# EAGLE schematic leddriver2X3 (EAGLE 9.4.2)
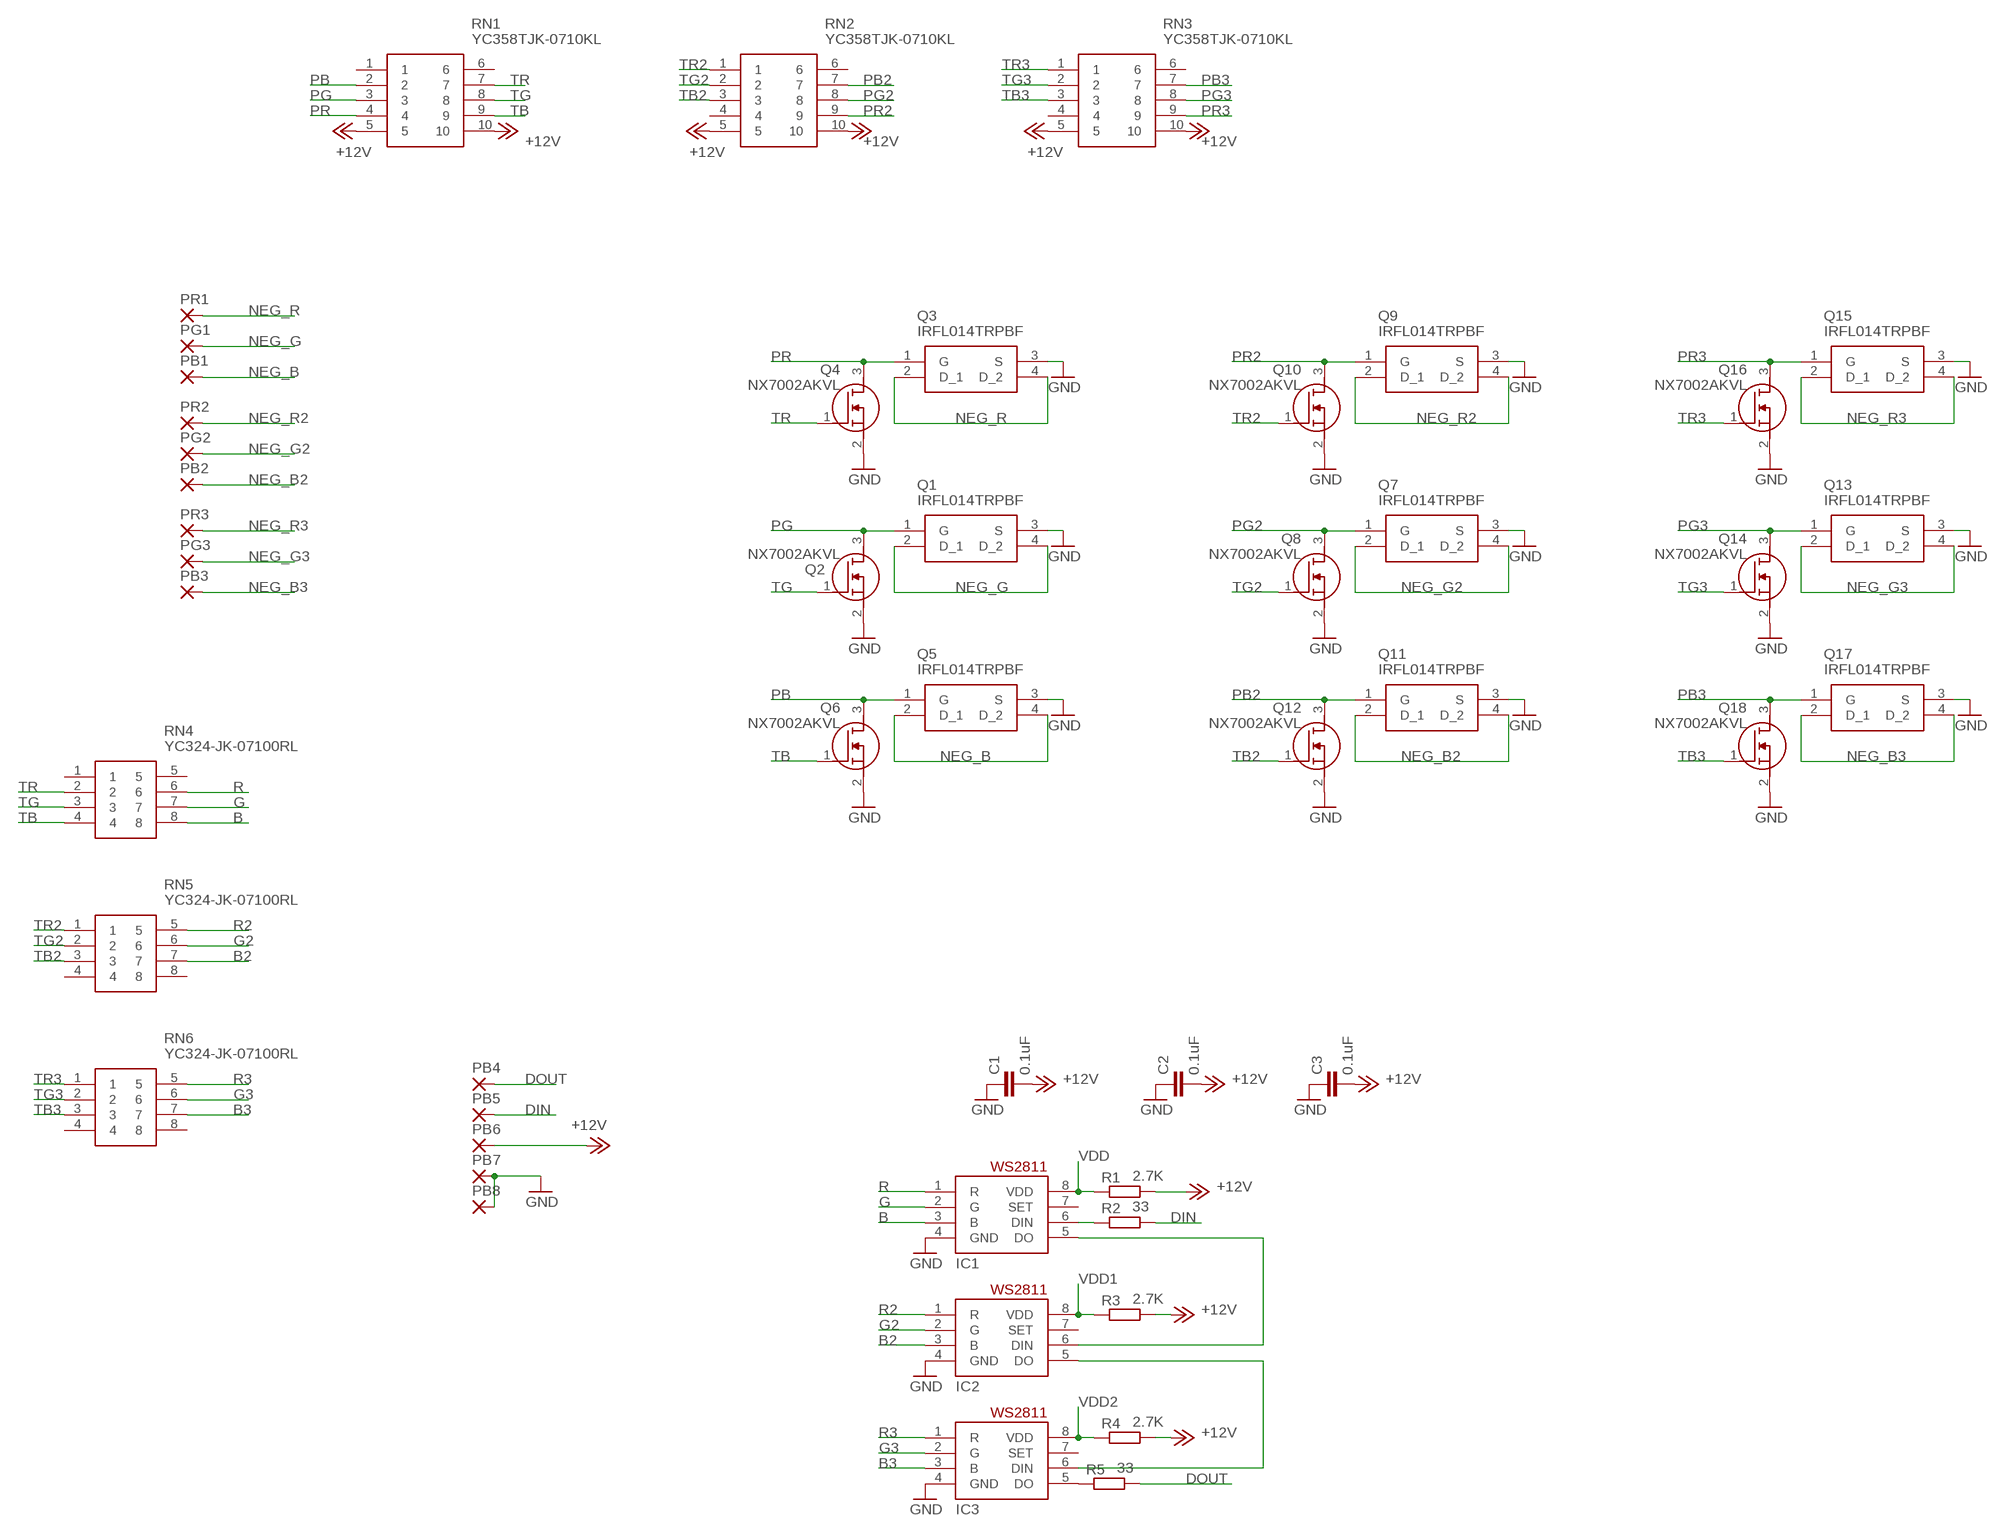
[diagram p0: schematic, sheet 1]

## Parts
C1  0.1uF  C-EUC1206  [C1206]
C2  0.1uF  C-EUC1206  [C1206]
C3  0.1uF  C-EUC1206  [C1206]
IC1  WS2811-SOP8  [SO08-SKINNYPADS]
IC2  WS2811-SOP8  [SO08-SKINNYPADS]
IC3  WS2811-SOP8  [SO08-SKINNYPADS]
PB1  3,81/1,4  [3,81/1,4]
PB2  3,81/1,4  [3,81/1,4]
PB3  3,81/1,4  [3,81/1,4]
PB4  3,81/1,4  [3,81/1,4]
PB5  3,81/1,4  [3,81/1,4]
PB6  3,81/1,4  [3,81/1,4]
PB7  3,81/1,4  [3,81/1,4]
PB8  3,81/1,4  [3,81/1,4]
PG1  3,81/1,4  [3,81/1,4]
PG2  3,81/1,4  [3,81/1,4]
PG3  3,81/1,4  [3,81/1,4]
PR1  3,81/1,4  [3,81/1,4]
PR2  3,81/1,4  [3,81/1,4]
PR3  3,81/1,4  [3,81/1,4]
Q1  IRFL014TRPBF  [SOT230P700X180-4N]
Q2  NX7002AKVL  [SOT95P230X110-3N]
Q3  IRFL014TRPBF  [SOT230P700X180-4N]
Q4  NX7002AKVL  [SOT95P230X110-3N]
Q5  IRFL014TRPBF  [SOT230P700X180-4N]
Q6  NX7002AKVL  [SOT95P230X110-3N]
Q7  IRFL014TRPBF  [SOT230P700X180-4N]
Q8  NX7002AKVL  [SOT95P230X110-3N]
Q9  IRFL014TRPBF  [SOT230P700X180-4N]
Q10  NX7002AKVL  [SOT95P230X110-3N]
Q11  IRFL014TRPBF  [SOT230P700X180-4N]
Q12  NX7002AKVL  [SOT95P230X110-3N]
Q13  IRFL014TRPBF  [SOT230P700X180-4N]
Q14  NX7002AKVL  [SOT95P230X110-3N]
Q15  IRFL014TRPBF  [SOT230P700X180-4N]
Q16  NX7002AKVL  [SOT95P230X110-3N]
Q17  IRFL014TRPBF  [SOT230P700X180-4N]
Q18  NX7002AKVL  [SOT95P230X110-3N]
R1  2.7K  R-EU_R1206  [R1206]
R2  33  R-EU_R1206  [R1206]
R3  2.7K  R-EU_R1206  [R1206]
R4  2.7K  R-EU_R1206  [R1206]
R5  33  R-EU_R1206  [R1206]
RN1  YC358TJK-0710KL  [YC358T]
RN2  YC358TJK-0710KL  [YC358T]
RN3  YC358TJK-0710KL  [YC358T]
RN4  YC324-JK-07100RL  [YC324JK07100RL]
RN5  YC324-JK-07100RL  [YC324JK07100RL]
RN6  YC324-JK-07100RL  [YC324JK07100RL]

## Nets
+12V: C1.2 C2.2 C3.2 PB6.1(P) R1.2 R3.2 R4.2 RN1.5 RN1.10 RN2.5 RN2.10 RN3.5 RN3.10
B: IC1.3(B) RN4.8
B2: IC2.3(B) RN5.7
B3: IC3.3(B) RN6.7
DIN: PB5.1(P) R2.2
DOUT: PB4.1(P) R5.2
G: IC1.2(G) RN4.7
G2: IC2.2(G) RN5.6
G3: IC3.2(G) RN6.6
GND: C1.1 C2.1 C3.1 IC1.4(GND) IC2.4(GND) IC3.4(GND) PB7.1(P) PB8.1(P) Q1.3(S) Q2.2(S) Q3.3(S) Q4.2(S) Q5.3(S) Q6.2(S) Q7.3(S) Q8.2(S) Q9.3(S) Q10.2(S) Q11.3(S) Q12.2(S) Q13.3(S) Q14.2(S) Q15.3(S) Q16.2(S) Q17.3(S) Q18.2(S)
N$1: IC1.6(DIN) R2.1
N$2: IC3.5(DO) R5.1
N$5: IC1.5(DO) IC2.6(DIN)
N$11: IC2.5(DO) IC3.6(DIN)
NEG_B: PB1.1(P) Q5.2(D_1) Q5.4(D_2)
NEG_B2: PB2.1(P) Q11.2(D_1) Q11.4(D_2)
NEG_B3: PB3.1(P) Q17.2(D_1) Q17.4(D_2)
NEG_G: PG1.1(P) Q1.2(D_1) Q1.4(D_2)
NEG_G2: PG2.1(P) Q7.2(D_1) Q7.4(D_2)
NEG_G3: PG3.1(P) Q13.2(D_1) Q13.4(D_2)
NEG_R: PR1.1(P) Q3.2(D_1) Q3.4(D_2)
NEG_R2: PR2.1(P) Q9.2(D_1) Q9.4(D_2)
NEG_R3: PR3.1(P) Q15.2(D_1) Q15.4(D_2)
PB: Q5.1(G) Q6.3(D) RN1.2
PB2: Q11.1(G) Q12.3(D) RN2.7
PB3: Q17.1(G) Q18.3(D) RN3.7
PG: Q1.1(G) Q2.3(D) RN1.3
PG2: Q7.1(G) Q8.3(D) RN2.8
PG3: Q13.1(G) Q14.3(D) RN3.8
PR: Q3.1(G) Q4.3(D) RN1.4
PR2: Q9.1(G) Q10.3(D) RN2.9
PR3: Q15.1(G) Q16.3(D) RN3.9
R: IC1.1(R) RN4.6
R2: IC2.1(R) RN5.5
R3: IC3.1(R) RN6.5
TB: Q6.1(G) RN1.9 RN4.4
TB2: Q12.1(G) RN2.3 RN5.3
TB3: Q18.1(G) RN3.3 RN6.3
TG: Q2.1(G) RN1.8 RN4.3
TG2: Q8.1(G) RN2.2 RN5.2
TG3: Q14.1(G) RN3.2 RN6.2
TR: Q4.1(G) RN1.7 RN4.2
TR2: Q10.1(G) RN2.1 RN5.1
TR3: Q16.1(G) RN3.1 RN6.1
VDD: IC1.8(VDD) R1.1
VDD1: IC2.8(VDD) R3.1
VDD2: IC3.8(VDD) R4.1
Unconnected: IC1.7(SET) IC2.7(SET) IC3.7(SET) RN1.1 RN1.6 RN2.4 RN2.6 RN3.4 RN3.6 RN4.1 RN4.5 RN5.4 RN5.8 RN6.4 RN6.8

## Library data of the parts
C1-C3 = rcl:C-EU: CAPACITOR, European symbol; SPICEPREFIX: C
IC1-IC3 = adafruit_wsled:WS2811
PB1-PB8 PG1-PG3 PR1-PR3 = wirepad:3,81/1,4: THROUGH-HOLE PAD
Q1 Q3 Q5 Q7 Q9 Q11 Q13 Q15 Q17 = SamacSys_Parts:IRFL014TRPBF: Vishay IRFL014TRPBF N-channel MOSFET Transistor, 2.7 A, 60 V, 3-Pin SOT-223 Source: Datasheet <https://componentsearchengine.com/Datasheets/1/IRFL014TRPBF.pdf>; DESCRIPTION: Vishay IRFL014TRPBF N-channel MOSFET Transistor, 2.7 A, 60 V, 3-Pin SOT-223; HEIGHT: 1.8mm; MANUFACTURER_NAME: Vishay; MANUFACTURER_PART_NUMBER: IRFL014TRPBF; MOUSER_PART_NUMBER: 844-IRFL014TRPBF; MOUSER_PRICE-STOCK: https://www.mouser.com/Search/Refine.aspx?Keyword=844-IRFL014TRPBF
Q2 Q4 Q6 Q8 Q10 Q12 Q14 Q16 Q18 = SamacSys_Parts:NX7002AKVL: Trans MOSFET N-CH 60V 0.19A 3-Pin TO-236AB Source: Datasheet <https://componentsearchengine.com/Datasheets/1/NX7002AKVL.pdf>; DESCRIPTION: Trans MOSFET N-CH 60V 0.19A 3-Pin TO-236AB; HEIGHT: 1.1mm; MANUFACTURER_NAME: Nexperia; MANUFACTURER_PART_NUMBER: NX7002AKVL; MOUSER_PART_NUMBER: 771-NX7002AKVL; MOUSER_PRICE-STOCK: https://www.mouser.com/Search/Refine.aspx?Keyword=771-NX7002AKVL
R1-R5 = rcl:R-EU_: RESISTOR, European symbol; SPICEPREFIX: R
RN1-RN3 = SamacSys_Parts:YC358TJK-0710KL: Resistor Networks & Arrays 10K 5% CONVEX SQUARE 8X1225 Source: Datasheet <https://componentsearchengine.com/Datasheets/1/YC358TJK-0710KL.pdf>; DESCRIPTION: Resistor Networks & Arrays 10K 5% CONVEX SQUARE 8X1225; HEIGHT: mm; MANUFACTURER_NAME: YAGEO (PHYCOMP); MANUFACTURER_PART_NUMBER: YC358TJK-0710KL; MOUSER_PART_NUMBER: 603-YC358TJK-0710KL; MOUSER_PRICE-STOCK: https://www.mouser.com/Search/Refine.aspx?Keyword=603-YC358TJK-0710KL
RN4-RN6 = SamacSys_Parts:YC324-JK-07100RL: Resistor Networks & Arrays Source: Datasheet <https://componentsearchengine.com/Datasheets/1/YC324-JK-07100RL.pdf>; DESCRIPTION: Resistor Networks & Arrays; HEIGHT: 0.6mm; MANUFACTURER_NAME: YAGEO (PHYCOMP); MANUFACTURER_PART_NUMBER: YC324-JK-07100RL; MOUSER_PART_NUMBER: 603-YC324-JK-07100RL; MOUSER_PRICE-STOCK: https://www.mouser.com/Search/Refine.aspx?Keyword=603-YC324-JK-07100RL